# EAGLE design vetinari_clock_reference (EAGLE 6.4)
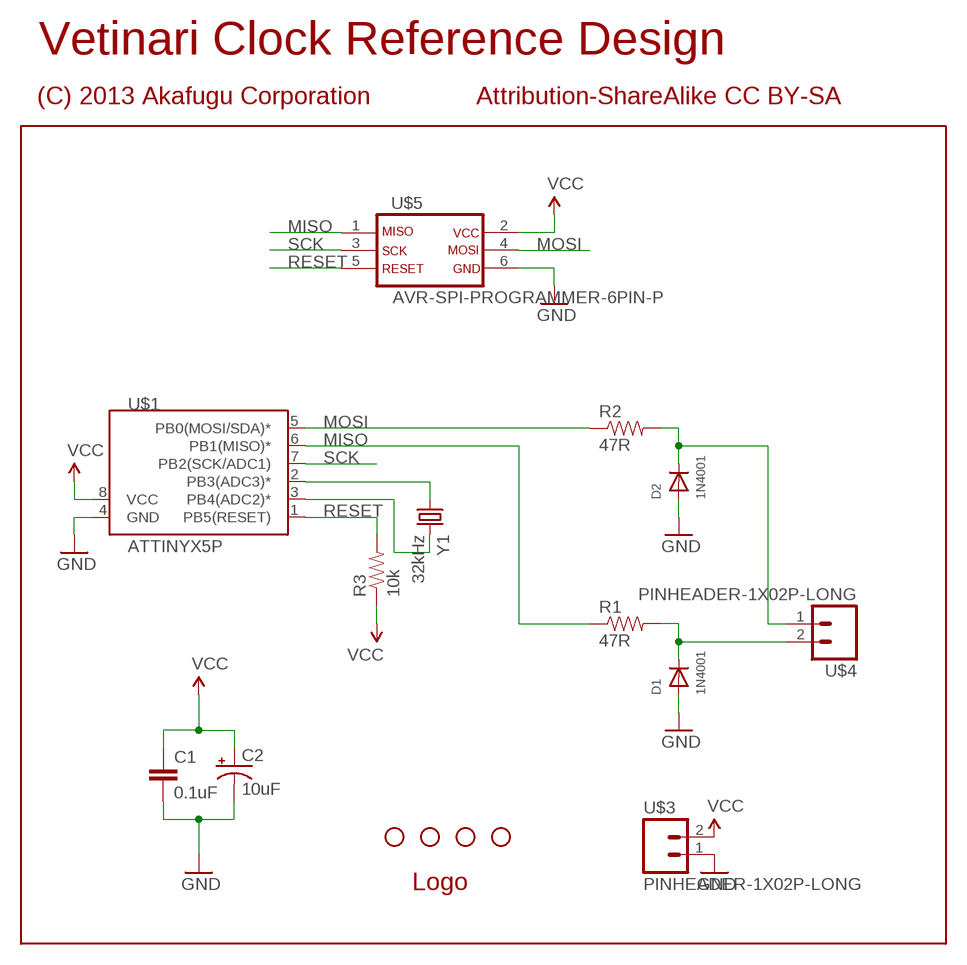
[diagram p0: schematic, sheet 1]

## Parts
C1  0.1uF  CAP-PTH-2.54MM  [CAP-PTH-2.54MM]
C2  10uF  CAP_POL-RADIAL-SLIM  [CPOL-RADIAL-SLIM]
D1  1N4001  DIODE-1N4001-BIGHOLES  [DIODE-1N4001-BIGHOLES]
D2  1N4001  DIODE-1N4001-BIGHOLES  [DIODE-1N4001-BIGHOLES]
JP1  STAND-OFF  [STAND-OFF]
JP2  STAND-OFF  [STAND-OFF]
JP3  STAND-OFF  [STAND-OFF]
JP4  STAND-OFF  [STAND-OFF]
R1  47R  RESISTOR-PTH-1/6W-OUTLINE  [1/6W-RES-OUTLINE]
R2  47R  RESISTOR-PTH-1/6W-OUTLINE  [1/6W-RES-OUTLINE]
R3  10k  RESISTOR-PTH-1/6W-OUTLINE  [1/6W-RES-OUTLINE]
U$1  ATTINYX5P  [DIL-8]
U$3  PINHEADER-1X02P-LONG  [1X02-LONG]
U$4  PINHEADER-1X02P-LONG  [1X02-LONG]
U$5  AVR-SPI-PROGRAMMER-6PIN-P  [2X03]
U$6  OSHW-LOGO-OUTLINE  [OSHW-LOGO-OUTLINE]
Y1  32kHz  CRYSTAL-TC38H  [TC38H]

## Nets
GND: C1.2 C2.2(-) D1.A D2.A U$1.4(GND) U$3.1 U$5.6
MISO: R1.1 U$1.6(PB1(MISO)*) U$5.1
MOSI: R2.1 U$1.5(PB0(MOSI/SDA)*) U$5.4
N$2: D1.C R1.2 U$4.2
N$3: U$1.2(PB3(ADC3)*) Y1.1
N$4: U$1.3(PB4(ADC2)*) Y1.2
N$5: D2.C R2.2 U$4.1
RESET: R3.2 U$1.1(PB5(RESET)) U$5.5
SCK: U$1.7(PB2(SCK/ADC1)) U$5.3
VCC: C1.1 C2.1(+) R3.1 U$1.8(VCC) U$3.2 U$5.2

## Notes on the sheet
- Vetinari Clock Reference Design
- (C) 2013 Akafugu Corporation | Attribution-ShareAlike CC BY-SA

## Library data of the parts
C1 = akafugu:CAP: Capacitor Standard 0603 ceramic capacitor, and 0.1" leaded capacitor.
C2 = akafugu:CAP_POL: Capacitor Polarized These are standard SMD and PTH capacitors. Normally 10uF, 47uF, and 100uF in electrolytic and tantalum varieties. Always verify the external diameter of the through hole cap, it varies with capacity, voltage, and manufacturer. The EIA devices should be standard.
D1 D2 = akafugu:DIODE: Diode SOD-123 20V 1 A (.5mV Vf) Schottky Diode - Digikey: MBRX120TPMSCT-ND
JP1-JP4 = SparkFun:STAND-OFF: Stand Off This is the mechanical footprint for a #4 phillips button head screw. Use the keepout ring to avoid running the screw head into surrounding components. SKU : PRT-00447
R1-R3 = akafugu:RESISTOR: Resistor Basic schematic elements and footprints for 0603, 1206, and PTH resistors.
U$1 = akafugu:ATTINYX5: ATTiny25/45/85 Microcontroller
U$3 U$4 = akafugu:PINHEADER-1X02
U$5 = akafugu:AVR-SPI-PROGRAMMER-6PIN: AVR SPI Programmer Header, 6-pin 2x3-pin PTH and 2x3 SMT pad
U$6 = akafugu:OSHW-LOGO
Y1 = akafugu:CRYSTAL: Crystals Various standard crystals. Proven footprints. Spark Fun Electronics SKU : COM-00534

## Net classes
0 default: width 0.254 mm, drill 0.305 mm, clearance 0.152 mm

## Board
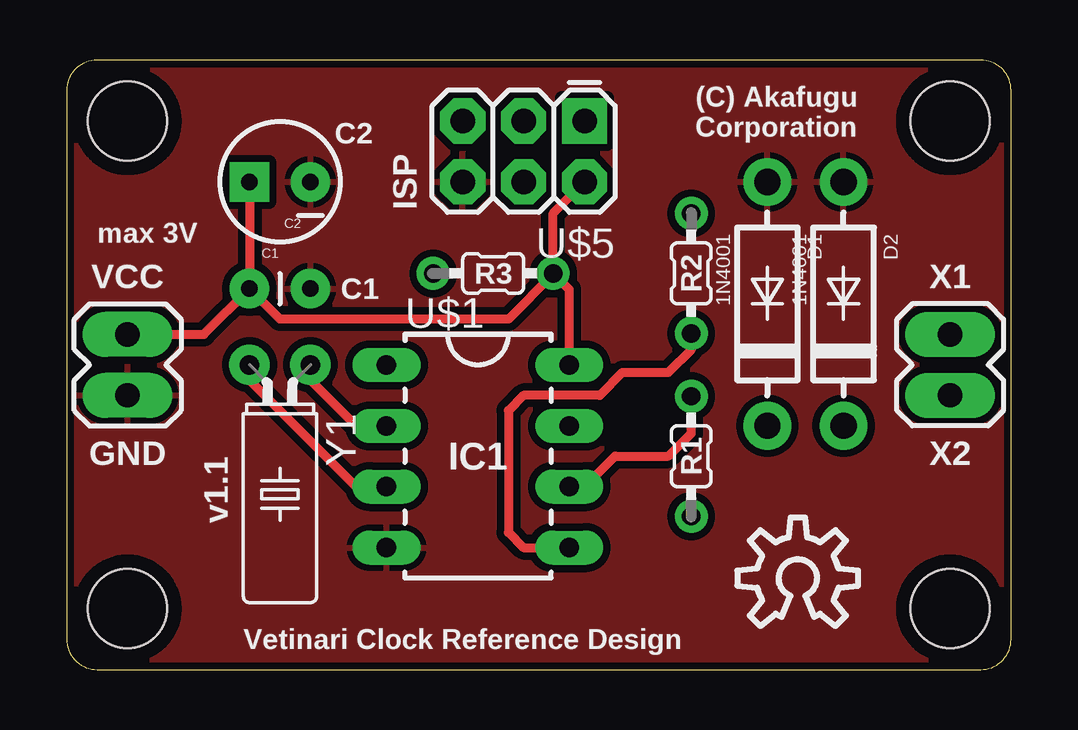
[diagram p1: board, top side]
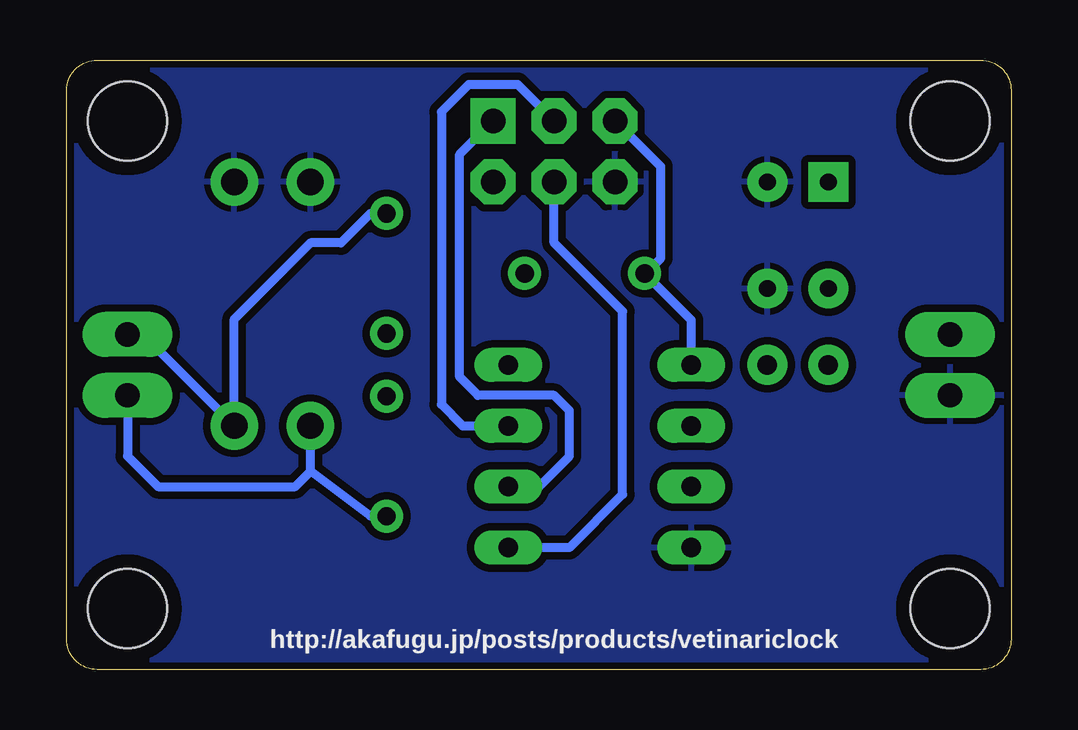
[diagram p2: board, bottom side, seen from below]

Size 39.37 x 25.4 mm. Coordinates in mm from the lower left corner, seen from the top.
Outline: 0,24.13 0,1.27 arc90 1.27,0 38.1,0 arc90 39.37,1.27 39.37,24.13 arc90 38.1,25.4 1.27,25.4 arc90 0,24.13
Copper layers (1*16): Top 0.035mm / dielectric 1.5mm / Bottom 0.035mm
Design rules "default": minimum track width 10mil, minimum drill 12mil, track to track 8mil, track to pad 8mil, pad to pad 8mil, via to via 8mil, smd to smd 0mil, copper to edge 12mil, drill to drill 10mil, minimum pad ring 12mil, minimum via ring 6mil, stop-mask expansion 2mil, vias tented up to drill 45mil, thermal gap 10mil

### Footprints (pad centres in the part's own frame; a part is rotated, then mirrored left to right if it is on the bottom)
CAP-PTH-2.54MM = drill 0.7 pad 1.651: 1 0,0; 2 2.54,0
CPOL-RADIAL-SLIM = drill 0.7 pad 1.651 square: 1 1.27,0 | drill 0.7 pad 1.651: 2 -1.27,0
DIODE-1N4001-BIGHOLES = drill 1.1 pad 1.981: A -5.08,0; C 5.08,0
STAND-OFF = hole 3.302: 0,0
1/6W-RES-OUTLINE = drill 0.762: 1 -2.5,0; 2 2.5,0
DIL-8 = drill 0.813 long: 1 -3.81,-3.81; 2 -1.27,-3.81; 3 1.27,-3.81; 4 3.81,-3.81; 5 3.81,3.81; 6 1.27,3.81; 7 -1.27,3.81; 8 -3.81,3.81
1X02-LONG = drill 1.016 pad 1.88 long: 1 -1.27,0; 2 1.27,0
2X03 = drill 1.016 pad 1.88 square: 1 -2.54,-1.27 | drill 1.016 pad 1.88 octagon: 2 -2.54,1.27; 3 0,-1.27; 4 0,1.27; 5 2.54,-1.27; 6 2.54,1.27
TC38H = drill 0.813 pad 1.676: 1 -1.27,0; 2 1.27,0

### Placement (x,y rotation side)
C1  7.62,15.88 0 top
C2  8.89,20.32 180 top
D1  29.21,15.24 270 top
D2  32.38,15.24 270 top
JP1  2.54,2.54 0 top
JP2  2.54,22.86 0 top
JP3  36.83,22.86 0 top
JP4  36.83,2.54 0 top
R1  26.04,8.89 270 top
R2  26.04,16.51 90 top
R3  17.78,16.51 180 top
U$1  17.14,8.89 270 top
U$3  2.54,12.7 90 top
U$4  36.83,12.7 270 top
U$5  19.05,21.59 180 top
U$6  30.48,3.81 0 top
Y1  8.89,12.7 180 top

### Tracks (layer width: path | path; a pad name or v marks a point on that pad's centre or on a via)
GND
  pour Top (isolate 0.305): -1.27,26.67 40.64,26.67 40.64,-1.27 -1.27,-1.27
  pour Bottom (isolate 0.305): -0.64,26.04 40.01,26.04 40.01,-0.64 -0.64,-0.64
MISO
  Top 0.381: U$1.6 21.59,7.62 22.86,8.89 25.08,8.89 26.04,9.84 R1.1
  Bottom 0.381: U$1.6 19.68,7.62 18.41,8.89 18.41,10.79 19.05,11.43 22.23,11.43 22.99,12.19 22.99,21.46 U$5.1
MOSI
  Top 0.381: U$1.5 19.05,5.08 18.41,5.71 18.41,10.79 19.05,11.43 22.23,11.43 23.18,12.38 25.08,12.38 26.04,13.34 R2.1
  Bottom 0.381: U$1.5 18.41,5.08 16.19,7.3 16.19,14.92 19.05,17.78 U$5.4
N$2
  Bottom 0.381: U$4.2 36.83,8.89 35.56,7.62 29.84,7.62 29.21,8.26 | 29.21,8.26 D1.C | R1.2 26.71,6.39 29.21,8.26
N$3
  Top 0.381: U$1.2 12.06,10.16 10.16,12.06 Y1.1
N$4
  Top 0.381: U$1.3 12.06,7.62 7.62,12.06 Y1.2
N$5
  Bottom 0.381: U$4.1 36.2,13.97 D2.C 32.38,14.61 29.21,17.78 27.94,17.78 26.71,19.01 R2.2
RESET
  Bottom 0.381: U$1.1 13.34,14.56 R3.2 15.24,16.51 14.61,17.14 14.61,20.95 U$5.5
SCK
  Bottom 0.381: U$5.3 20.57,24.38 22.61,24.38 23.75,23.24 23.75,11.05 22.86,10.16 U$1.7
VCC
  Top 0.381: C2.1 C1.1 | U$3.2 5.71,13.97 C1.1 | U$1.8 20.95,15.84 R3.1 | R3.1 20.28,19.01 U$5.2 | R3.1 20.28,16.47 18.41,14.61 8.89,14.61 C1.1

### Text on the board
tPlace: (C) Akafugu / Corporation | C2 | ISP | max 3V | R3 | R2 | VCC | C1 | X1 | GND | X2 | v1.1 | IC1 | R1 | Vetinari Clock Reference Design
bPlace: http://akafugu.jp/posts/products/vetinariclock